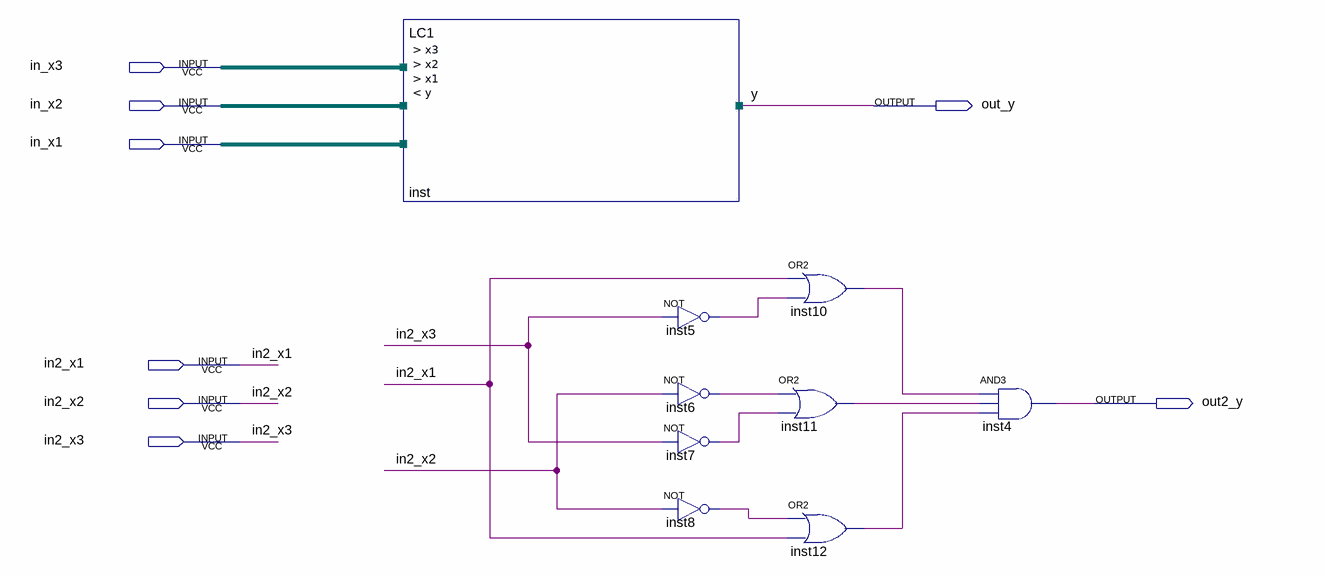
[diagram p0: schematic sheet]
// Quartus schematic CL_korinenko_Project_v1.bdf as structural Verilog: 9 symbols, 8 pins
module CL_korinenko_Project_v1 (
  input  in_x3,
  input  in_x2,
  input  in_x1,
  input  in2_x1,
  input  in2_x2,
  input  in2_x3,
  output out_y,
  output out2_y
);

  wire inst5_out, inst6_out, inst7_out, inst8_out, inst10_out, inst11_out, inst12_out;

  LC1 inst (.x3(in_x3), .x2(in_x2), .x1(in_x1), .y(out_y));
  not inst5 (inst5_out, in2_x3);
  not inst6 (inst6_out, in2_x2);
  not inst7 (inst7_out, in2_x3);
  not inst8 (inst8_out, in2_x2);
  or inst10 (inst10_out, in2_x1, inst5_out);
  or inst11 (inst11_out, inst6_out, inst7_out);
  or inst12 (inst12_out, inst8_out, in2_x1);
  and inst4 (out2_y, inst10_out, inst11_out, inst12_out);

  // Other names for the same wires on the sheet: y = out_y
endmodule
